# EAGLE design rangkaian (EAGLE 9.6.2)
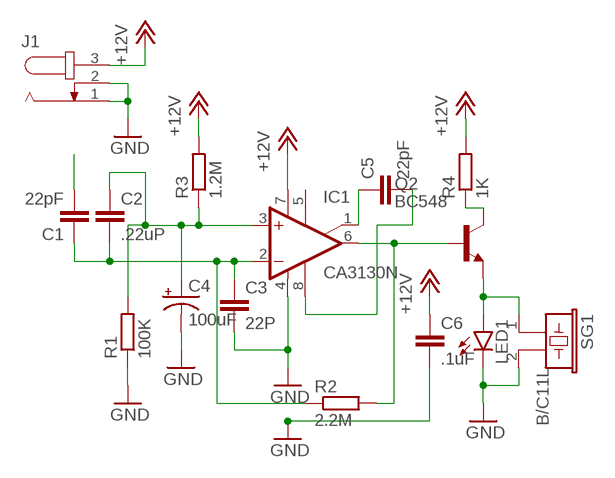
[diagram p0: schematic, sheet 1]

## Parts
C1  22pF  C-EU025-025X050  [C025-025X050]
C2  .22uP  C-EU025-025X050  [C025-025X050]
C3  22P  C-EU025-025X050  [C025-025X050]
C4  100uF  CPOL-USE3.5-8  [E3,5-8]
C5  22pF  C-EU025-025X050  [C025-025X050]
C6  .1uF  C-EU025-025X050  [C025-025X050]
IC1  CA3130N  [DIL08]
J1  JACK-PLUG0  [SPC4077]
LED1  LED5MM  [LED5MM]
Q2  BC548  [TO92-EBC]
R1  100K  R-EU_0204/7  [0204/7]
R2  2.2M  R-EU_0204/7  [0204/7]
R3  1.2M  R-EU_0204/7  [0204/7]
R4  1K  R-EU_0204/7  [0204/7]
SG1  B/C11L  [B/C11L]

## Nets
+12V: C6.1 IC1.7(V+) J1.3 R3.2 R4.2
GND: C3.2 C4.- C6.2 IC1.4(V-) J1.1 J1.2 LED1.K(C) R1.1 SG1.2
N$1: C1.2
N$2: C1.1 C2.2 C3.1 IC1.2(-IN) R2.1
N$3: C2.1 C4.+ IC1.3(+IN) R1.2 R3.1
N$6: IC1.6(OUT) Q2.B R2.2
N$7: LED1.A Q2.E SG1.1
N$8: Q2.C R4.1
N$11: C5.2 IC1.8(CMP)
N$12: C5.1 IC1.1(ON/CMP)
Unconnected: IC1.5(ON)

## Library data of the parts
C1-C3 C5 C6 = rcl:C-EU: CAPACITOR, European symbol; SPICEPREFIX: C
C4 = rcl:CPOL-US: POLARIZED CAPACITOR, American symbol; SPICEPREFIX: C
IC1 = linear:CA3130: OP AMP
J1 = con-jack:JACK-PLUG: DC POWER JACK Power Jack, DC, Right Angle, Through Hole, Rated 5A at 16VDC, PC Terminals Distributor: Farnell (www.Farnell.de) Drawing: 84N1161.pdf / 84N1162.pdf Manufacturer: SPC Technology (www.spctechnology.com) Type: SPC4077 / SPC 4078; OC_FARNELL: unknown; OC_NEWARK: unknown
LED1 = led:LED: LED OSRAM: - CHIPLED LG R971, LG N971, LY N971, LG Q971, LY Q971, LO R971, LY R971 LH N974, LH R974 LS Q976, LO Q976, LY Q976 LO Q996 - Hyper CHIPLED LW Q18S LB Q993, LB Q99A, LB R99A - SideLED LS A670, LO A670, LY A670, LG A670, LP A670 LB A673, LV A673, LT A673, LW A673 LH A674 LY A675 LS A676, LA A676, LO A676, LY A676, LW A676 LS A679, LY A679, LG A679 - Hyper Micro SIDELED® LS Y876, LA Y876, LO Y876, LY Y876 LT Y87S - SmartLED LW L88C, LW L88S LB L89C, LB L89S, LG L890 LS L89K, LO L89K, LY L89K LS L896, LA L896, LO L896, LY L896 - TOPLED LS T670, LO T670, LY T670, LG T670, LP T670 LSG T670, LSP T670, LSY T670, LOP T670, LYG T670 LG T671, LOG T671, LSG T671 LB T673, LV T673, LT T673, LW T673 LH T674 LS T676, LA T676, LO T676, LY T676, LB T676, LH T676, LSB T676, LW T676 LB T67C, LV T67C, LT T67C, LS T67K, LO T67K, LY T67K, LW E67C LS E67B, LA E67B, LO E67B, LY E67B, LB E67C, LV E67C, LT E67C LW T67C LS T679, LY T679, LG T679 LS T770, LO T770, LY T770, LG T770, LP T770 LB T773, LV T773, LT T773, LW T773 LH T774 LS E675, LA E675, LY E675, LS T675 LS T776, LA T776, LO T776, LY T776, LB T776 LHGB T686 LT T68C, LB T68C - Hyper Mini TOPLED® LB M676 - Mini TOPLED Santana® LG M470 LS M47K, LO M47K, LY M47K Source: http://www.osram.convergy.de LUXEON: - LUMILED® LXK2-PW12-R00, LXK2-PW12-S00, LXK2-PW14-U00, LXK2-PW14-V00 LXK2-PM12-R00, LXK2-PM12-S00, LXK2-PM14-U00 LXK2-PE12-Q00, LXK2-PE12-R00, LXK2-PE12-S00, LXK2-PE14-T00, LXK2-PE14-U00 LXK2-PB12-K00, LXK2-PB12-L00, LXK2-PB12-M00, LXK2-PB14-N00, LXK2-PB14-P00, LXK2-PB14-Q00 LXK2-PR12-L00, LXK2-PR12-M00, LXK2-PR14-Q00, LXK2-PR14-R00 LXK2-PD12-Q00, LXK2-PD12-R00, LXK2-PD12-S00 LXK2-PH12-R00, LXK2-PH12-S00 LXK2-PL12-P00, LXK2-PL12-Q00, LXK2-PL12-R00 Source: www.luxeon.com KINGBRIGHT: KA-3528ASYC Source: www.kingbright.com
Q2 = transistor-npn:BC548*: NPN Transistor
R1-R4 = rcl:R-EU_: RESISTOR, European symbol; SPICEPREFIX: R
SG1 = buzzer:B/C11L: BUZZER Source: Buerklin; OC_FARNELL: unknown; OC_NEWARK: unknown

## Board
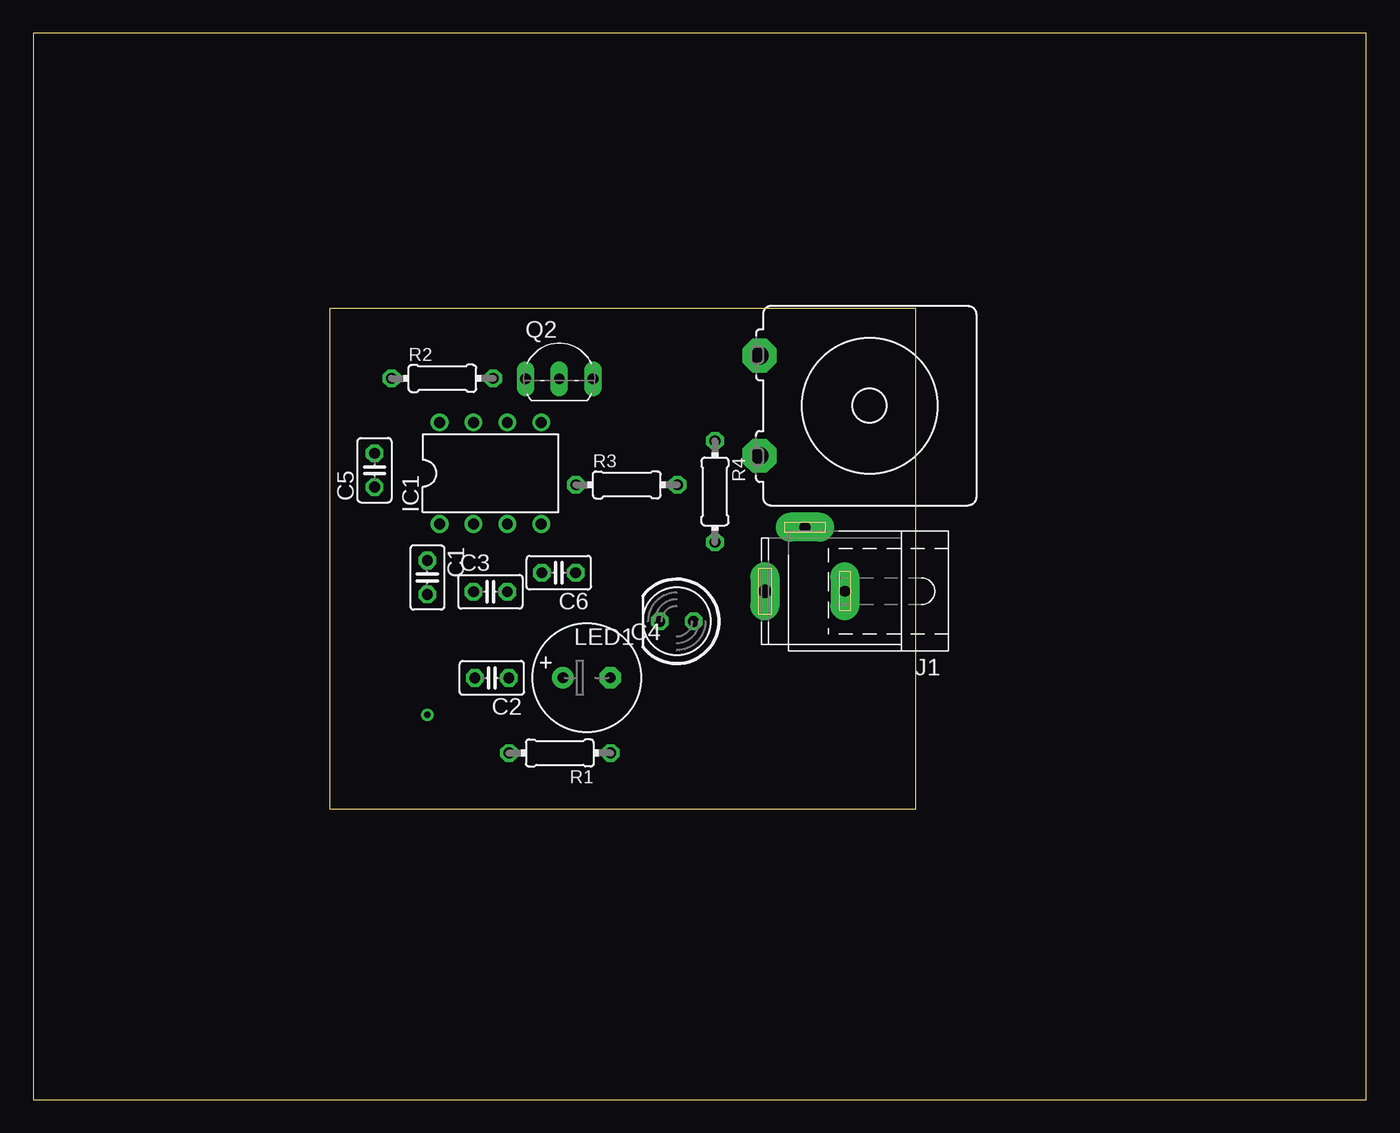
[diagram p1: board, top side]
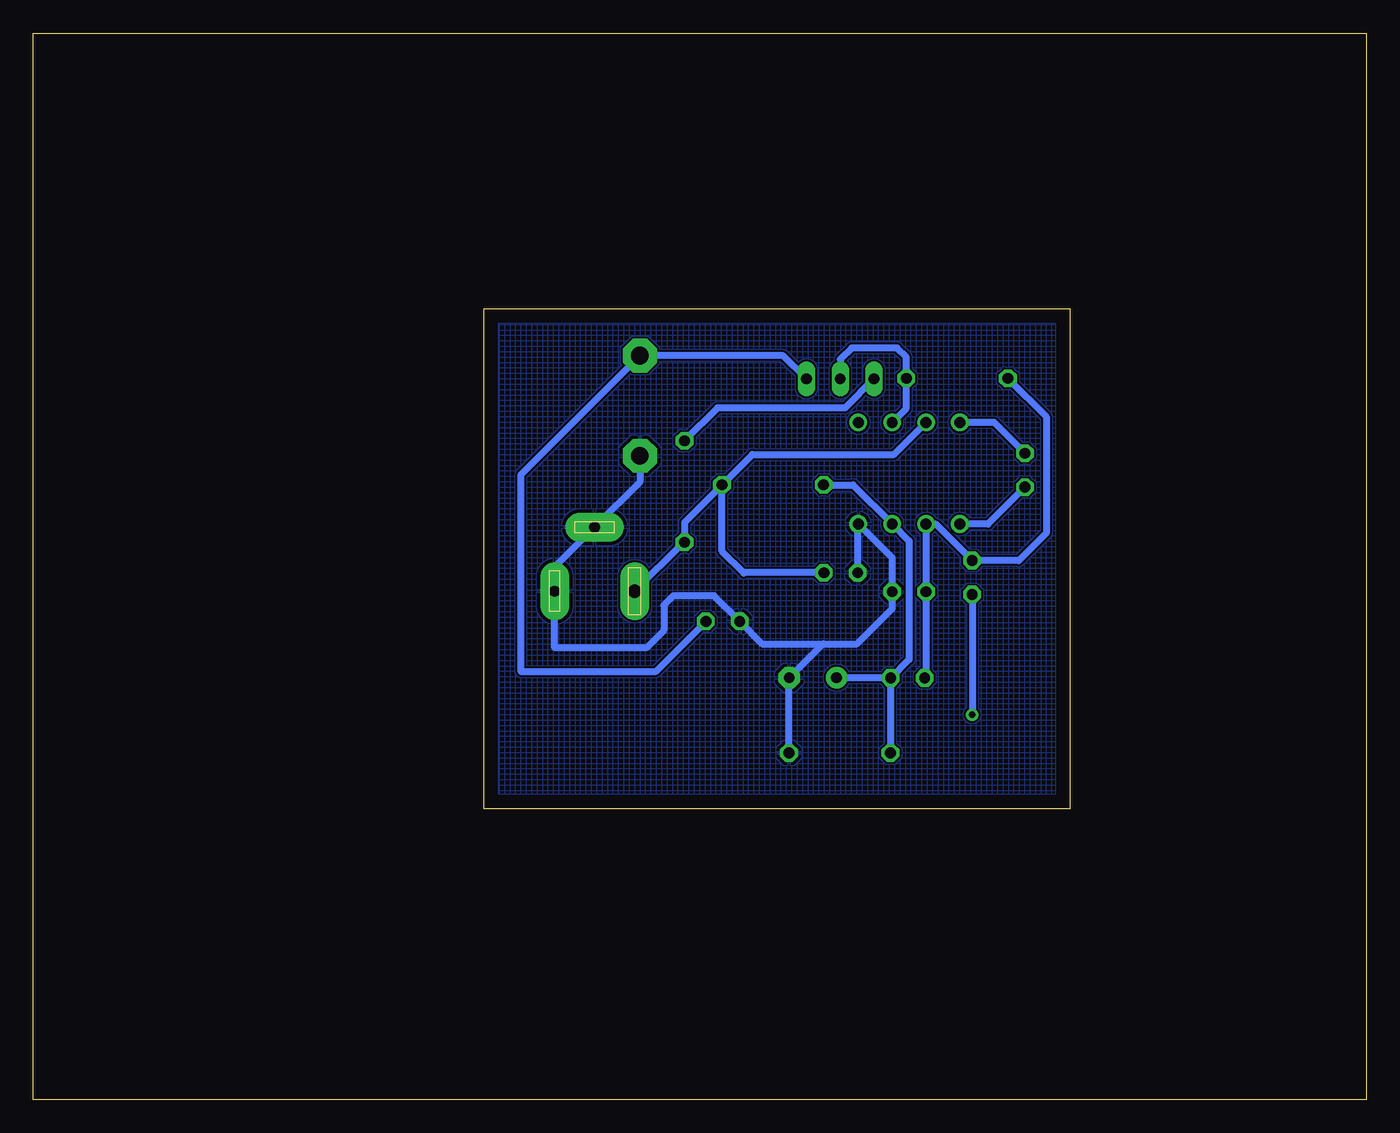
[diagram p2: board, bottom side, seen from below]

Size 100 x 80 mm. Coordinates in mm from the lower left corner, seen from the top.
Outline: 0,0 100,0 100,80 0,80 0,0
Outline: 22.22,59.33 22.22,21.79 66.2,21.79 66.2,59.33 22.22,59.33
Copper layers (1*16): Top 0.035mm / dielectric 1.5mm / Bottom 0.035mm
Design rules "default": minimum track width 6mil, minimum drill 0.35mm, track to track 6mil, track to pad 6mil, pad to pad 6mil, via to via 6mil, smd to smd 6mil, copper to edge 40mil, drill to drill 6mil, minimum pad ring 10mil, minimum via ring 8mil, stop-mask expansion 4mil, vias tented up to drill 0mil, thermal gap 10mil

### Footprints (pad centres in the part's own frame; a part is rotated, then mirrored left to right if it is on the bottom)
C025-025X050 = drill 0.813 octagon: 1 -1.27,0; 2 1.27,0
E3,5-8 = drill 0.813 pad 1.6: + -1.778,0 | drill 0.813 pad 1.6 octagon: - 1.778,0
DIL08 = drill 0.813 pad 1.27: 1 -3.81,-3.81; 2 -1.27,-3.81; 3 1.27,-3.81; 4 3.81,-3.81; 5 3.81,3.81; 6 1.27,3.81; 7 -1.27,3.81; 8 -3.81,3.81
SPC4077 = drill 0.8 pad 2.184 long: 1 -3,0; 2 0,-4.8 | drill 1 pad 2.184 long: 3 3,0
LED5MM = drill 0.813 octagon: A -1.27,0; K 1.27,0
TO92-EBC = drill 0.813 long: B 0,-1.27; C -2.54,-1.27; E 2.54,-1.27
0204/7 = drill 0.813 octagon: 1 -3.81,0; 2 3.81,0
B/C11L = drill 1.321 pad 2.54 octagon: 1 -3.759,-8.255; 2 3.759,-8.255

### Placement (x,y rotation side)
C1  29.56,39.17 270 top
C2  34.4,31.63 180 top
C3  34.29,38.1 0 top
C4  41.51,31.65 0 top
C5  25.6,47.22 90 top
C6  39.42,39.53 180 top
IC1  34.29,46.99 0 top
J1  57.89,38.14 180 top
LED1  48.27,35.88 180 top
Q2  39.46,55.35 0 top
R1  39.5,26 180 top
R2  30.69,54.11 0 top
R3  44.52,46.12 0 top
R4  51.14,45.62 270 top
SG1  62.74,52.06 270 top

### Tracks (layer width: path | path; a pad name or v marks a point on that pad's centre or on a via)
+12V
  Bottom 0.508: C6.1 46.67,39.53 46.7,39.5 48.33,41.13 R3.2 | R3.2 51.14,43.31 R4.2 51.22,41.81 J1.3 | R3.2 46.05,48.4 35.42,48.4 IC1.7
GND
  Bottom 0.508: C6.2 38.15,43.13 IC1.4 35.56,40.64 C3.2 35.56,36.84 38.2,34.2 40.74,34.2 | R1.1 43.31,31.63 C4.- 40.74,34.2 | SG1.2 54.49,46.34 J1.2 60.89,39.94 J1.1 60.89,33.9 54,33.9 52.7,35.2 52.7,37.1 52,37.8 48.92,37.8 LED1.K 45.32,34.2 40.74,34.2
  pour Bottom (isolate 0.1, hatched): 22.12,59.33 66.1,59.33 66.1,21.79 22.12,21.79
N$1  (via drill 0.5 pad 0.7)
  Bottom 0.508: C1.2 v29.56,28.87
N$2
  Bottom 0.508: C2.2 33.02,31.74 C3.1 IC1.2 32.3,43.18 C1.1 26.06,40.44 24,42.5 24,51.23 R2.1
N$3
  Bottom 0.508: R3.1 38.5,46.12 IC1.3 34.3,41.92 34.3,33 35.69,31.61 | 35.69,31.61 arc90 C2.1 39.72,31.63 C4.+ | 35.69,31.61 R1.2
N$6
  Bottom 0.508: Q2.B 39.46,55.54 38.6,56.4 35.2,56.4 34.5,55.7 R2.2 34.5,51.86 IC1.6
N$7
  Bottom 0.508: LED1.A 53.32,32.1 63.4,32.1 63.4,46.91 SG1.1 43.74,55.82 Q2.E
N$8
  Bottom 0.508: Q2.C 39.1,51.9 48.67,51.9 R4.1
N$11
  Bottom 0.508: C5.2 27.91,50.8 IC1.8
N$12
  Bottom 0.508: C5.1 28.37,43.18 IC1.1